# EAGLE board main (EAGLE 9.6.2), part 1 of 2
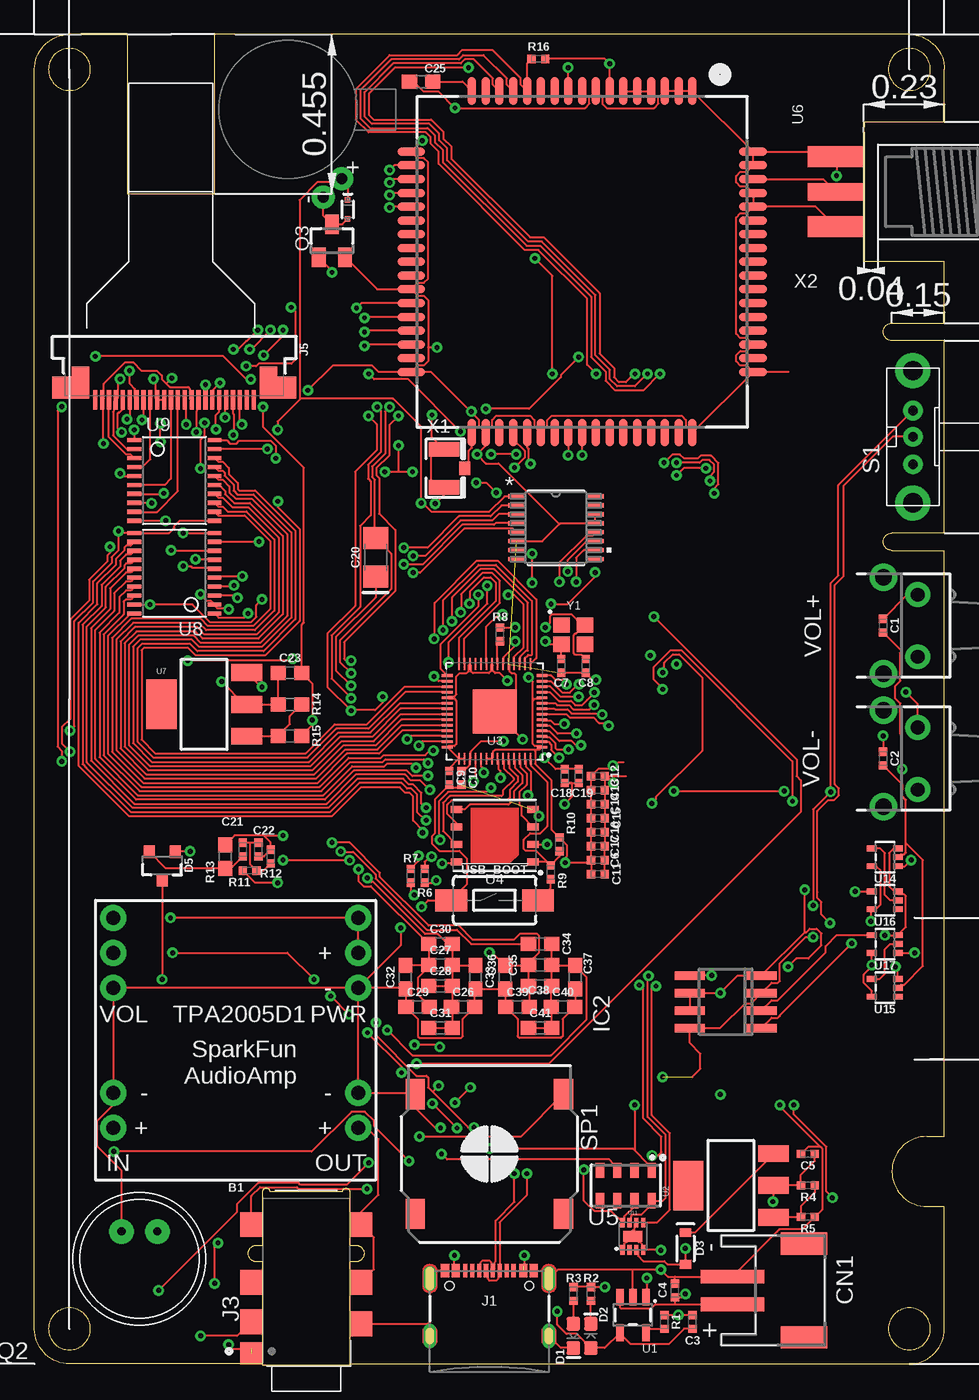
[diagram p1: board, top side]
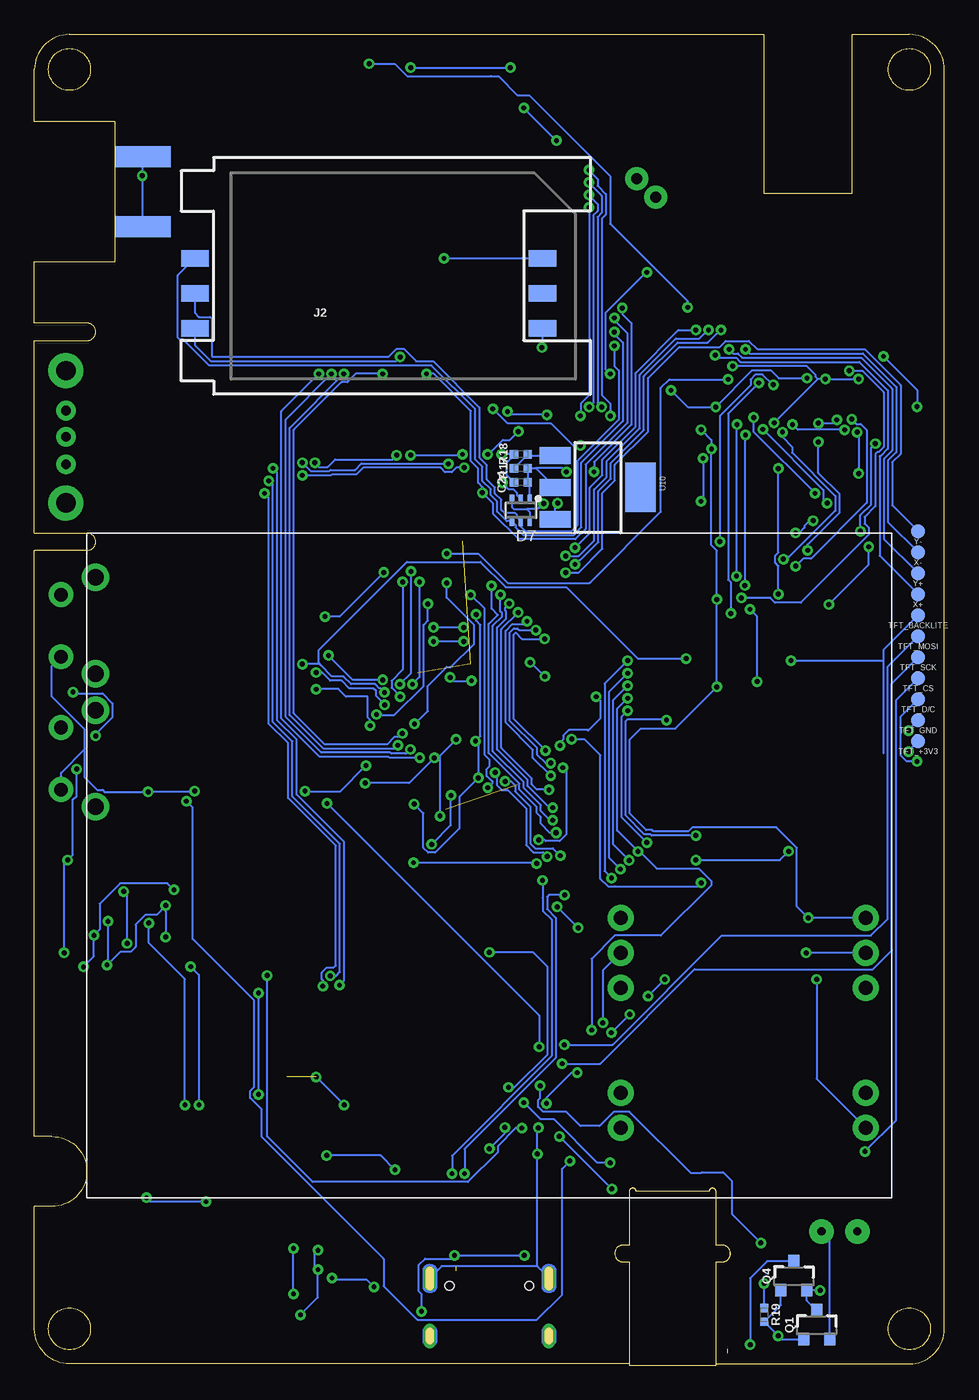
[diagram p2: board, bottom side, seen from below]

Size 66.04 x 96.52 mm. Coordinates in mm from the lower left corner, seen from the top.
Outline: 63.5,96.52 13.08,96.52 13.08,84.96 6.73,84.96 6.73,96.52 2.54,96.52 arc90 0,93.98 0,2.54 arc90 2.54,0 16.57,0 16.57,7.4 16.13,7.4 arc-90 15.52,8.01 arc-90 16.13,8.62 16.57,8.62 16.57,12.51 arc-90 16.83,12.76 16.84,12.76 arc-90 17.08,12.52 22.36,12.52 arc-90 22.61,12.76 22.62,12.76 arc-90 22.87,12.51 22.87,8.61 23.33,8.61 arc-90 23.93,8.01 arc-90 23.32,7.4 22.87,7.4 22.87,0 63.5,0 arc90 66.04,2.54 66.04,11.43 64.77,11.43 arc-90 62.23,13.97 arc-90 64.77,16.51 66.04,16.51 66.04,59.05 62.23,59.05 arc-180 62.23,60.33 66.04,60.33 66.04,74.3 62.23,74.3 arc-180 62.23,75.56 66.04,75.56 66.04,80.01 60.2,80.01 60.2,90.17 66.04,90.17 66.04,93.98 arc90 63.5,96.52
Outline: 63.5,4.06 arc90 61.98,2.54 arc90 63.5,1.02 arc90 65.02,2.54 arc90 63.5,4.06
Outline: 63.5,95.5 arc90 61.98,93.98 arc90 63.5,92.46 arc90 65.02,93.98 arc90 63.5,95.5
Outline: 2.54,95.5 arc90 1.02,93.98 arc90 2.54,92.46 arc90 4.06,93.98 arc90 2.54,95.5
Outline: 2.54,4.06 arc90 1.02,2.54 arc90 2.54,1.02 arc90 4.06,2.54 arc90 2.54,4.06
Copper layers (1*16): Top 0.035mm / dielectric 1.5mm / Bottom 0.035mm
Design rules "default": minimum track width 6mil, minimum drill 0.35mm, track to track 6mil, track to pad 6mil, pad to pad 6mil, via to via 6mil, smd to smd 6mil, copper to edge 40mil, drill to drill 6mil, minimum pad ring 10mil, minimum via ring 8mil, stop-mask expansion 4mil, vias tented up to drill 0mil, thermal gap 10mil

## Footprints (pad centres in the part's own frame; a part is rotated, then mirrored left to right if it is on the bottom)
TACTILE_SWITCH_SMD_6.0X3.5MM = smd 2.3 x 1.6: 1 -3.15,0; 2 3.15,0
AUDIO-AMP-MONO = drill 1.016 pad 1.88: IN+ 8.89,6.35; IN- 8.89,3.81; OUT+ -8.89,6.35; OUT- -8.89,3.81; PWR+ -8.89,-6.35; PWR- -8.89,-3.81; S -8.89,-8.89; VOL 8.89,-6.35; VOL+ 8.89,-8.89; VOL- 8.89,-3.81
0402-TIGHT = smd 0.6 x 0.6: 1 -0.5,0; 2 0.5,0
1206-POLAR = smd 1.6 x 1.8: 1 -1.4,0; 2 1.4,0
0603 = smd 1.1 x 1: 1 -0.85,0; 2 0.85,0
JST-PH-2-SMT-RA = smd 1 x 4.6: 1 1,-3.7; 2 -1,-3.7 | smd 1.6 x 3.4: NC1 -3.4,1.5; NC2 3.4,1.5
LED-0603 = smd 1 x 1: A -0.877,0; C 0.877,0
SOD-323 = smd 0.63 x 0.83: A 1.15,0; C -1.15,0
SOT23-3 = smd 0.8 x 0.9: 1 -0.95,-1; 2 0.95,-1; 3 0,1.1
SOD-523 = smd 0.4 x 0.4: A -0.7,0; C 0.7,0
SOT363 = smd 0.3 x 0.7: 1 -0.65,-0.8; 2 0,-0.8; 3 0.65,-0.8; 4 0.65,0.8; 5 0,0.8; 6 -0.65,0.8
SOIC08 = smd 0.6 x 2.2: 1 -1.905,-2.6; 2 -0.635,-2.6; 3 0.635,-2.6; 4 1.905,-2.6; 5 1.905,2.6; 6 0.635,2.6; 7 -0.635,2.6; 8 -1.905,2.6
USB-C-16P-2LAYER-PADS = smd 0.3 x 1: A5 -1.25,-0.34; A6 -0.25,-0.34; A7 0.25,-0.34; A8 1.25,-0.34; B5 1.75,-0.34; B6 0.75,-0.34; B7 -0.75,-0.34; B8 -1.75,-0.34 | smd 0.6 x 1: GND -3.225,-0.34; GND2 3.225,-0.34; VBUS1 -2.45,-0.34; VBUS2 2.45,-0.34 | drill 0.4 pad 0.6 long: SHLD1 -4.318,-0.915; SHLD2 4.318,-0.915; SHLD3 -4.318,-5.095; SHLD4 4.318,-5.095 | hole 0.65: -2.89,-1.445; 2.89,-1.445
SIMHOLDER = smd 2 x 1.2: C1 -12.61,-3.81; C2 -12.61,-1.27; C3 -12.61,1.27; C5 12.61,-3.81; C6 12.61,-1.27; C7 12.61,1.27
CUI_SJ-43617-SMT = smd 1.6 x 1.65: 1 0,0 | smd 1.8 x 1.65: 2 9.35,-7.95; 3 5.15,-7.95; 4 2.15,-7.95; 10 9.35,0; 11 5.15,0; 12 2.3,0
FPC-24-AMPHENOL-SFV24R-1STE1HLF = smd 0.3 x 1.4: 1 5.75,2.4; 2 5.25,2.4; 3 4.75,2.4; 4 4.25,2.4; 5 3.75,2.4; 6 3.25,2.4; 7 2.75,2.4; 8 2.25,2.4; 9 1.75,2.4; 10 1.25,2.4; 11 0.75,2.4; 12 0.25,2.4; 13 -0.25,2.4; 14 -0.75,2.4; 15 -1.25,2.4; 16 -1.75,2.4; 17 -2.25,2.4; 18 -2.75,2.4; 19 -3.25,2.4; 20 -3.75,2.4; 21 -4.25,2.4; 22 -4.75,2.4; 23 -5.25,2.4; 24 -5.75,2.4 | smd 1.4 x 1.6: MNT1@0 -8.15,1.5; MNT2@1 8.15,1.5 | smd 1.25 x 2.3: MNT1@1 -6.825,1.15; MNT2@0 6.825,1.15
VIBE-MOTOR-10MM = drill 0.8 pad 1.676: + -5,-3.9; - -6.35,-2.54
9.7ELECTRET = drill 0.6 pad 1.778: + 1.3,2; - -1.3,2
TRANSISTOR-NPN_SC59-BEC = smd 1 x 1.4: B -0.95,-1.2; C 0,1.2; E 0.95,-1.2
EG1213 = drill 0.7 pad 1.422: 1 -2,0; 2 0,0; 3 1.9,0 | drill 1.4 pad 2.54: MT1 -4.8,0; MT2 4.8,0
SMS-1308MS-2-R = smd 1.4 x 2.2: + -5.375,-4.35; - 5.375,-4.35; M1 -5.375,4.35; M2 5.375,4.35
TP10R = smd 1 x 1: TP 0,0
SOT23-5 = smd 0.55 x 1.2: 1 -0.95,-1.3; 2 0,-1.3; 3 0.95,-1.3; 4 0.95,1.3; 5 -0.95,1.3
SOT223 = smd 1.219 x 2.235: 1 -2.311,-3.099; 2 0,-3.099; 3 2.311,-3.099 | smd 3.6 x 2.2: 4 0,3.099
QFN-56 = smd 0.875 x 0.2: 1 -3.437,2.6; 2 -3.437,2.2; 3 -3.437,1.8; 4 -3.437,1.4; 5 -3.437,1; 6 -3.437,0.6; 7 -3.437,0.2; 8 -3.437,-0.2; 9 -3.437,-0.6; 10 -3.437,-1; 11 -3.437,-1.4; 12 -3.437,-1.8; 13 -3.437,-2.2; 14 -3.437,-2.6; 29 3.437,-2.6; 30 3.437,-2.2; 31 3.437,-1.8; 32 3.437,-1.4; 33 3.437,-1; 34 3.437,-0.6; 35 3.437,-0.2; 36 3.437,0.2; 37 3.437,0.6; 38 3.437,1; 39 3.437,1.4; 40 3.437,1.8; 41 3.437,2.2; 42 3.437,2.6 | smd 0.2 x 0.875: 15 -2.6,-3.437; 16 -2.2,-3.437; 17 -1.8,-3.437; 18 -1.4,-3.437; 19 -1,-3.437; 20 -0.6,-3.437; 21 -0.2,-3.437; 22 0.2,-3.437; 23 0.6,-3.437; 24 1,-3.437; 25 1.4,-3.437; 26 1.8,-3.437; 27 2.2,-3.437; 28 2.6,-3.437; 43 2.6,3.437; 44 2.2,3.437; 45 1.8,3.437; 46 1.4,3.437; 47 1,3.437; 48 0.6,3.437; 49 0.2,3.437; 50 -0.2,3.437; 51 -0.6,3.437; 52 -1,3.437; 53 -1.4,3.437; 54 -1.8,3.437; 55 -2.2,3.437; 56 -2.6,3.437 | smd 3.2 x 3.2: EPAD 0,0
WSON-8-6X5 = smd 0.85 x 0.5: 1 -2.775,1.905; 2 -2.775,0.635; 3 -2.775,-0.635; 4 -2.775,-1.905; 5 2.775,-1.905; 6 2.775,-0.635; 7 2.775,0.635; 8 2.775,1.905
MS8607-02BA01 = smd 1.1 x 0.6: 1 -1.1,1.875; 2 -1.1,0.625; 3 -1.1,-0.625; 4 -1.1,-1.875; 5 1.1,-1.875; 6 1.1,-0.625; 7 1.1,0.625; 8 1.1,1.875
SIM900_SMT = smd 2 x 0.6: P$1 -12.4,8; P$2 -12.4,7; P$3 -12.4,6; P$4 -12.4,5; P$5 -12.4,4; P$6 -12.4,3; P$7 -12.4,2; P$8 -12.4,1; P$9 -12.4,0; P$10 -12.4,-1; P$11 -12.4,-2; P$12 -12.4,-3; P$13 -12.4,-4; P$14 -12.4,-5; P$15 -12.4,-6; P$16 -12.4,-7; P$17 -12.4,-8; P$35 12.4,-8; P$36 12.4,-7; P$37 12.4,-6; P$38 12.4,-5; P$39 12.4,-4; P$40 12.4,-3; P$41 12.4,-2; P$42 12.4,-1; P$43 12.4,0; P$44 12.4,1; P$45 12.4,2; P$46 12.4,3; P$47 12.4,4; P$48 12.4,5; P$49 12.4,6; P$50 12.4,7; P$51 12.4,8 | smd 0.6 x 2: P$18 -8,-12.4; P$19 -7,-12.4; P$20 -6,-12.4; P$21 -5,-12.4; P$22 -4,-12.4; P$23 -3,-12.4; P$24 -2,-12.4; P$25 -1,-12.4; P$26 0,-12.4; P$27 1,-12.4; P$28 2,-12.4; P$29 3,-12.4; P$30 4,-12.4; P$31 5,-12.4; P$32 6,-12.4; P$33 7,-12.4; P$34 8,-12.4; P$52 8,12.4; P$53 7,12.4; P$54 6,12.4; P$55 5,12.4; P$56 4,12.4; P$57 3,12.4; P$58 2,12.4; P$59 1,12.4; P$60 0,12.4; P$61 -1,12.4; P$62 -2,12.4; P$63 -3,12.4; P$64 -4,12.4; P$65 -5,12.4; P$66 -6,12.4; P$67 -7,12.4; P$68 -8,12.4
TSSOP20 = smd 0.305 x 0.991: 1 -2.925,-2.918; 2 -2.275,-2.918; 3 -1.625,-2.918; 4 -0.975,-2.918; 5 -0.325,-2.918; 6 0.325,-2.918; 7 0.975,-2.918; 8 1.625,-2.918; 9 2.275,-2.918; 10 2.925,-2.918; 11 2.925,2.918; 12 2.275,2.918; 13 1.625,2.918; 14 0.975,2.918; 15 0.325,2.918; 16 -0.325,2.918; 17 -0.975,2.918; 18 -1.625,2.918; 19 -2.275,2.918; 20 -2.925,2.918
DFN-8 = smd 0.3 x 0.7: 1 -0.75,-0.99; 2 -0.25,-0.99; 3 0.25,-0.99; 4 0.75,-0.99; 5 0.75,0.99; 6 0.25,0.99; 7 -0.25,0.99; 8 -0.75,0.99 | smd 1.38 x 0.8: 9 0,0
PW16-L = smd 1.168 x 0.305: 1 -2.87,2.275; 2 -2.87,1.625; 3 -2.87,0.975; 4 -2.87,0.325; 5 -2.87,-0.325; 6 -2.87,-0.975; 7 -2.87,-1.625; 8 -2.87,-2.275; 9 2.87,-2.275; 10 2.87,-1.625; 11 2.87,-0.975; 12 2.87,-0.325; 13 2.87,0.325; 14 2.87,0.975; 15 2.87,1.625; 16 2.87,2.275
SOT353 = smd 0.42 x 0.7: 1 -0.65,-0.95; 2 0,-0.95; 3 0.65,-0.95; 4 0.65,0.95; 5 -0.65,0.95
TACTILE_SWITCH_PTH_RA_8-020 = drill 1 pad 1.8: 1 -2.25,0; 2 2.25,0 | drill 1.2 pad 2: M1 -3.5,2.5; M2 3.5,2.5
U.FL = smd 2.2 x 1.05: 1 0,1.375; 2 0,-1.375 | smd 0.8 x 1: 3 1.525,0
SMA_EDGELAUNCH = smd 4.064 x 1.524: GND@1 2.032,-2.54; GND@2 2.032,2.54 | smd 4.064 x 1.524 bottom: GND@3 2.032,2.54; GND@4 2.032,-2.54 | smd 4.064 x 1.27: P 2.032,0
CRYSTAL-SMD-2X2.5MM = smd 1.2 x 1.1: P1 0.846,0.69; P2 -0.854,0.69; P3 -0.854,-0.71; P4 0.846,-0.71

## Placement (x,y rotation side)
!USB_BOOT  MOMENTARY-SWITCH-SPST-SMD-6.0X3.5MM  [TACTILE_SWITCH_SMD_6.0X3.5MM]  33.4,33.66 0 top
B1  SPARKFUN_AUDIO-AMP-MONODIP  [AUDIO-AMP-MONO]  14.61,23.5 180 top
C1  10uF  [0402-TIGHT]  61.59,53.59 270 top
C2  10uF  [0402-TIGHT]  61.59,43.94 270 top
C3  10uF  [0402-TIGHT]  47.75,3.05 90 top
C4  10uF  [0402-TIGHT]  46.48,5.33 90 top
C5  10uF  [0402-TIGHT]  56.13,15.24 180 top
C6  0.1uF  [0402-TIGHT]  40.89,36.58 0 top
C7  27pF  [0402-TIGHT]  38.23,50.67 90 top
C8  27pF  [0402-TIGHT]  40.01,50.67 90 top
C9  1.0uF  [0402-TIGHT]  30.1,42.55 270 top
C10  1.0uF  [0402-TIGHT]  30.99,42.55 270 top
C11  0.1uF  [0402-TIGHT]  40.89,35.56 0 top
C12  0.1uF  [0402-TIGHT]  40.89,42.67 0 top
C13  0.1uF  [0402-TIGHT]  40.89,41.66 0 top
C14  0.1uF  [0402-TIGHT]  40.89,40.64 0 top
C15  0.1uF  [0402-TIGHT]  40.89,39.62 0 top
C16  0.1uF  [0402-TIGHT]  40.89,38.61 0 top
C17  0.1uF  [0402-TIGHT]  40.89,37.59 0 top
C18  0.1uF  [0402-TIGHT]  38.48,42.67 90 top
C19  0.1uF  [0402-TIGHT]  39.5,42.67 90 top
C20  100uF  [1206-POLAR]  24.77,58.55 90 top
C21  47uF  [0402-TIGHT]  15.11,37.34 270 top
C22  0.1uF  [0402-TIGHT]  16.26,37.34 270 top
C23  10uF  [0603]  18.54,50.16 0 top
C24  10uF  [0402-TIGHT]  30.73,64.01 180 bottom
C25  10uF  [0603]  28.07,93.09 180 top
C26  33pF  [0603]  31.11,25.91 0 top
C27  33pF  [0603]  29.46,28.96 0 top
C28  33pF  [0603]  29.46,27.43 0 top
C29  33pF  [0603]  27.81,25.91 0 top
C30  10pF  [0603]  29.46,30.48 0 top
C31  10pF  [0603]  29.46,24.38 0 top
C32  10pF  [0603]  26.92,28.07 90 top
C33  10pF  [0603]  32,28.07 270 top
C34  33pF  [0603]  36.7,30.48 0 top
C35  33pF  [0603]  36.7,28.96 0 top
C36  33pF  [0603]  34.16,28.07 90 top
C37  33pF  [0603]  39.24,28.07 270 top
C38  10pF  [0603]  36.7,27.43 0 top
C39  10pF  [0603]  35.05,25.91 0 top
C40  10pF  [0603]  38.35,25.91 0 top
C41  10pF  [0603]  36.7,24.38 0 top
CN1  [JST-PH-2-SMT-RA]  54.36,5.33 270 top
D1  Green  [LED-0603]  39.12,2.03 270 top
D2  Red  [LED-0603]  40.39,2.03 90 top
D3  3A/10V/280mV  [SOD-323]  47.24,8.38 270 top
D5  BAS70-05  [SOT23-3]  9.27,36.2 180 top
D6  120mA/40V/370mV  [SOD-523]  22.73,83.82 90 top
D7  BAV70S,115  [SOT363]  30.73,61.98 180 bottom
IC2  X9C102S  [SOIC08]  50.16,26.29 90 top
J1  [USB-C-16P-2LAYER-PADS]  33.02,7.11 0 top
J2  [SIMHOLDER]  41.78,78.99 0 bottom
J3  SJ-43617-SMT  [CUI_SJ-43617-SMT]  15.75,0.76 90 top
J5  CAMERA-HIMAXBOTTOM-CONTACT  [FPC-24-AMPHENOL-SFV24R-1STE1HLF]  10.16,72.39 180 top
M1  MOTOR10MM  [VIBE-MOTOR-10MM]  18.41,91.06 90 top
Q1  600mA/40V  [SOT23-3]  9.27,2.79 0 bottom
Q2  [9.7ELECTRET]  7.62,7.62 0 top
Q3  TRANSISTOR-NPN_MUN2211  [TRANSISTOR-NPN_SC59-BEC]  21.59,81.53 0 top
Q4  600mA/40V  [SOT23-3]  10.92,6.35 0 bottom
R1  2.0K  [0402-TIGHT]  45.72,3.05 270 top
R2  47  [0402-TIGHT]  40.39,5.08 90 top
R3  47  [0402-TIGHT]  39.12,5.08 90 top
R4  330  [0402-TIGHT]  56.13,12.95 180 top
R5  560Ω  [0402-TIGHT]  56.13,10.67 180 top
R6  27OHM  [0402-TIGHT]  28.32,35.43 90 top
R7  27OHM  [0402-TIGHT]  27.3,35.43 90 top
R8  1k  [0402-TIGHT]  33.78,52.96 270 top
R9  1k  [0402-TIGHT]  37.47,35.69 90 top
R10  DNP  [0402-TIGHT]  38.1,37.72 90 top
R11  220  [0402-TIGHT]  15.62,35.81 0 top
R12  100  [0402-TIGHT]  17.14,36.83 90 top
R13  1.8k  [0603]  13.84,36.83 270 top
R14  12.1k  [0603]  18.54,47.88 180 top
R15  15k  [0603]  18.54,45.59 180 top
R16  10k  [0402-TIGHT]  36.58,94.74 0 top
R17  2.2k  [0402-TIGHT]  30.73,65.02 0 bottom
R18  1k  [0402-TIGHT]  30.73,66.04 0 bottom
R19  1k  [0402-TIGHT]  13.08,3.56 270 bottom
S1  EG1213  [EG1213]  63.75,67.31 90 top
SP1  SMS-1308MS-2-R  [SMS-1308MS-2-R]  33.02,15.24 180 top
TFT_+3V3  TPTP10R  [TP10R]  1.91,45.21 180 bottom
TFT_BACKLITE  TPTP10R  [TP10R]  1.91,54.36 180 bottom
TFT_CS  TPTP10R  [TP10R]  1.91,49.78 180 bottom
TFT_D/C  TPTP10R  [TP10R]  1.91,48.26 180 bottom
TFT_GND  TPTP10R  [TP10R]  1.91,46.74 180 bottom
TFT_MOSI  TPTP10R  [TP10R]  1.91,52.83 180 bottom
TFT_SCK  TPTP10R  [TP10R]  1.91,51.31 180 bottom
U1  MCP73831  [SOT23-5]  43.43,3.56 180 top
U2  V_REG_317SMD  [SOT223]  50.55,12.95 90 top
U3  RP2040  [QFN-56]  33.4,47.37 180 top
U4  W25Q32JVZPIQ  [WSON-8-6X5]  33.4,38.35 180 top
U5  MS8607-02BA01  [MS8607-02BA01]  42.93,12.95 270 top
U6  [SIM900_SMT]  39.75,80.01 270 top
U7  V_REG_317SMD  [SOT223]  12.32,47.88 90 top
U8  [TSSOP20]  10.16,57.4 90 top
U9  [TSSOP20]  10.16,64.14 270 top
U10  V_REG_317SMD  [SOT223]  25.15,63.63 270 bottom
U11  MAX17048  [DFN-8]  43.43,9.27 0 top
U12  TSC2007IPWRPW16-L  [PW16-L]  37.85,60.71 0 top
U14  SN74LVC1G32DCKR  [SOT353]  61.72,36.78 90 top
U15  74LVC1G04SE  [SOT353]  61.72,27.3 90 top
U16  74LVC1G04SE  [SOT353]  61.72,33.66 90 top
U17  SN74LVC1G32DCKR  [SOT353]  61.72,30.48 90 top
VOL+  MOMENTARY-SWITCH-SPST-PTH-RIGHT-ANGLE-8-020  [TACTILE_SWITCH_PTH_RA_8-020]  64.11,53.59 90 top
VOL-  MOMENTARY-SWITCH-SPST-PTH-RIGHT-ANGLE-8-020  [TACTILE_SWITCH_PTH_RA_8-020]  64.11,43.94 90 top
X1  [U.FL]  29.72,65.02 0 top
X2  [SMA_EDGELAUNCH]  60.2,85.09 180 top
X+  TPTP10R  [TP10R]  1.91,55.88 180 bottom
X-  TPTP10R  [TP10R]  1.91,58.93 180 bottom
Y1  [CRYSTAL-SMD-2X2.5MM]  39.12,52.96 0 top
Y+  TPTP10R  [TP10R]  1.91,57.4 180 bottom
Y-  TPTP10R  [TP10R]  1.91,60.45 180 bottom